# Altium schematic sheet Buzzer_Block.SchDoc
size A4; CheckedBy: CT-Energys; Author: CT-Energys; CompanyName: HTD COMPANY LIMITED; DrawnBy: CHITOAN; Engineer: CHITOAN; Organization: Altium Limited; Address1: HO CHI MINH CITY; Address2: VIETNAM
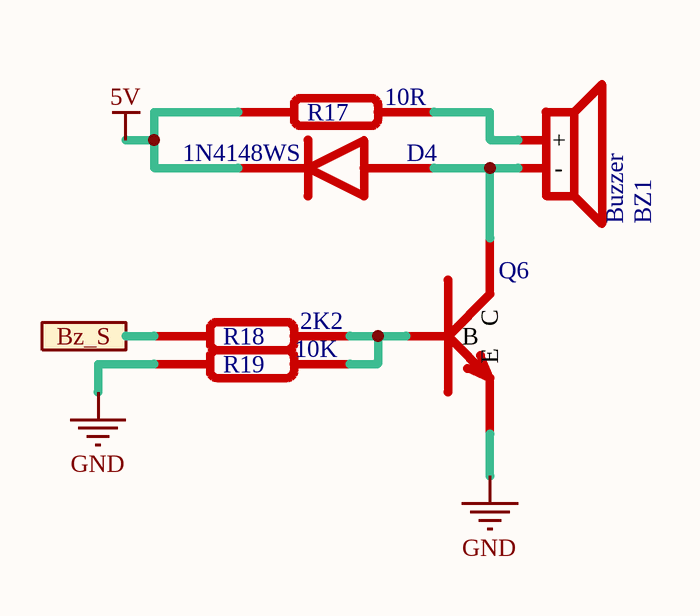
[diagram p0: Buzzer_Block.SchDoc]

## Parts
BZ1  Buzzer  [AST0927MW-03TRQ]
D4  1N4148WS  [SMA]
Q6  S8050  [SOT-23]  (value not drawn)
R17  10R  [R0603]
R18  2K2  [R0603]
R19  10K  [R0603]

## Ports
Bz_S

## Nets
5V: D4.K R17.2
GND: Q6.2(E) R19.2
Bz_S: R18.2 ; port Bz_S
NetBZ1_1: BZ1.1(+) R17.1
NetBZ1_2: BZ1.2(-) D4.A Q6.3(C)
NetQ6_1: Q6.1(B) R18.1 R19.1

## Notes on the sheet
- Title
- Size:
- Date:
- A4
- Number:
- Time:
- Revision:
- Design by:
- Company:
- File:

## Library data of the parts
BZ1 = Buzzer: Voltage Rate 5V, Current 50mA
D4 = 1N4148WS: Small Signal Diode
Q6 = S8050: NPN Transistors 0.5A Collector to Emitter 25V
R17-R19 = Resistor